# Altium schematic sheet DAM16_Ethernet.SchDoc
size A3
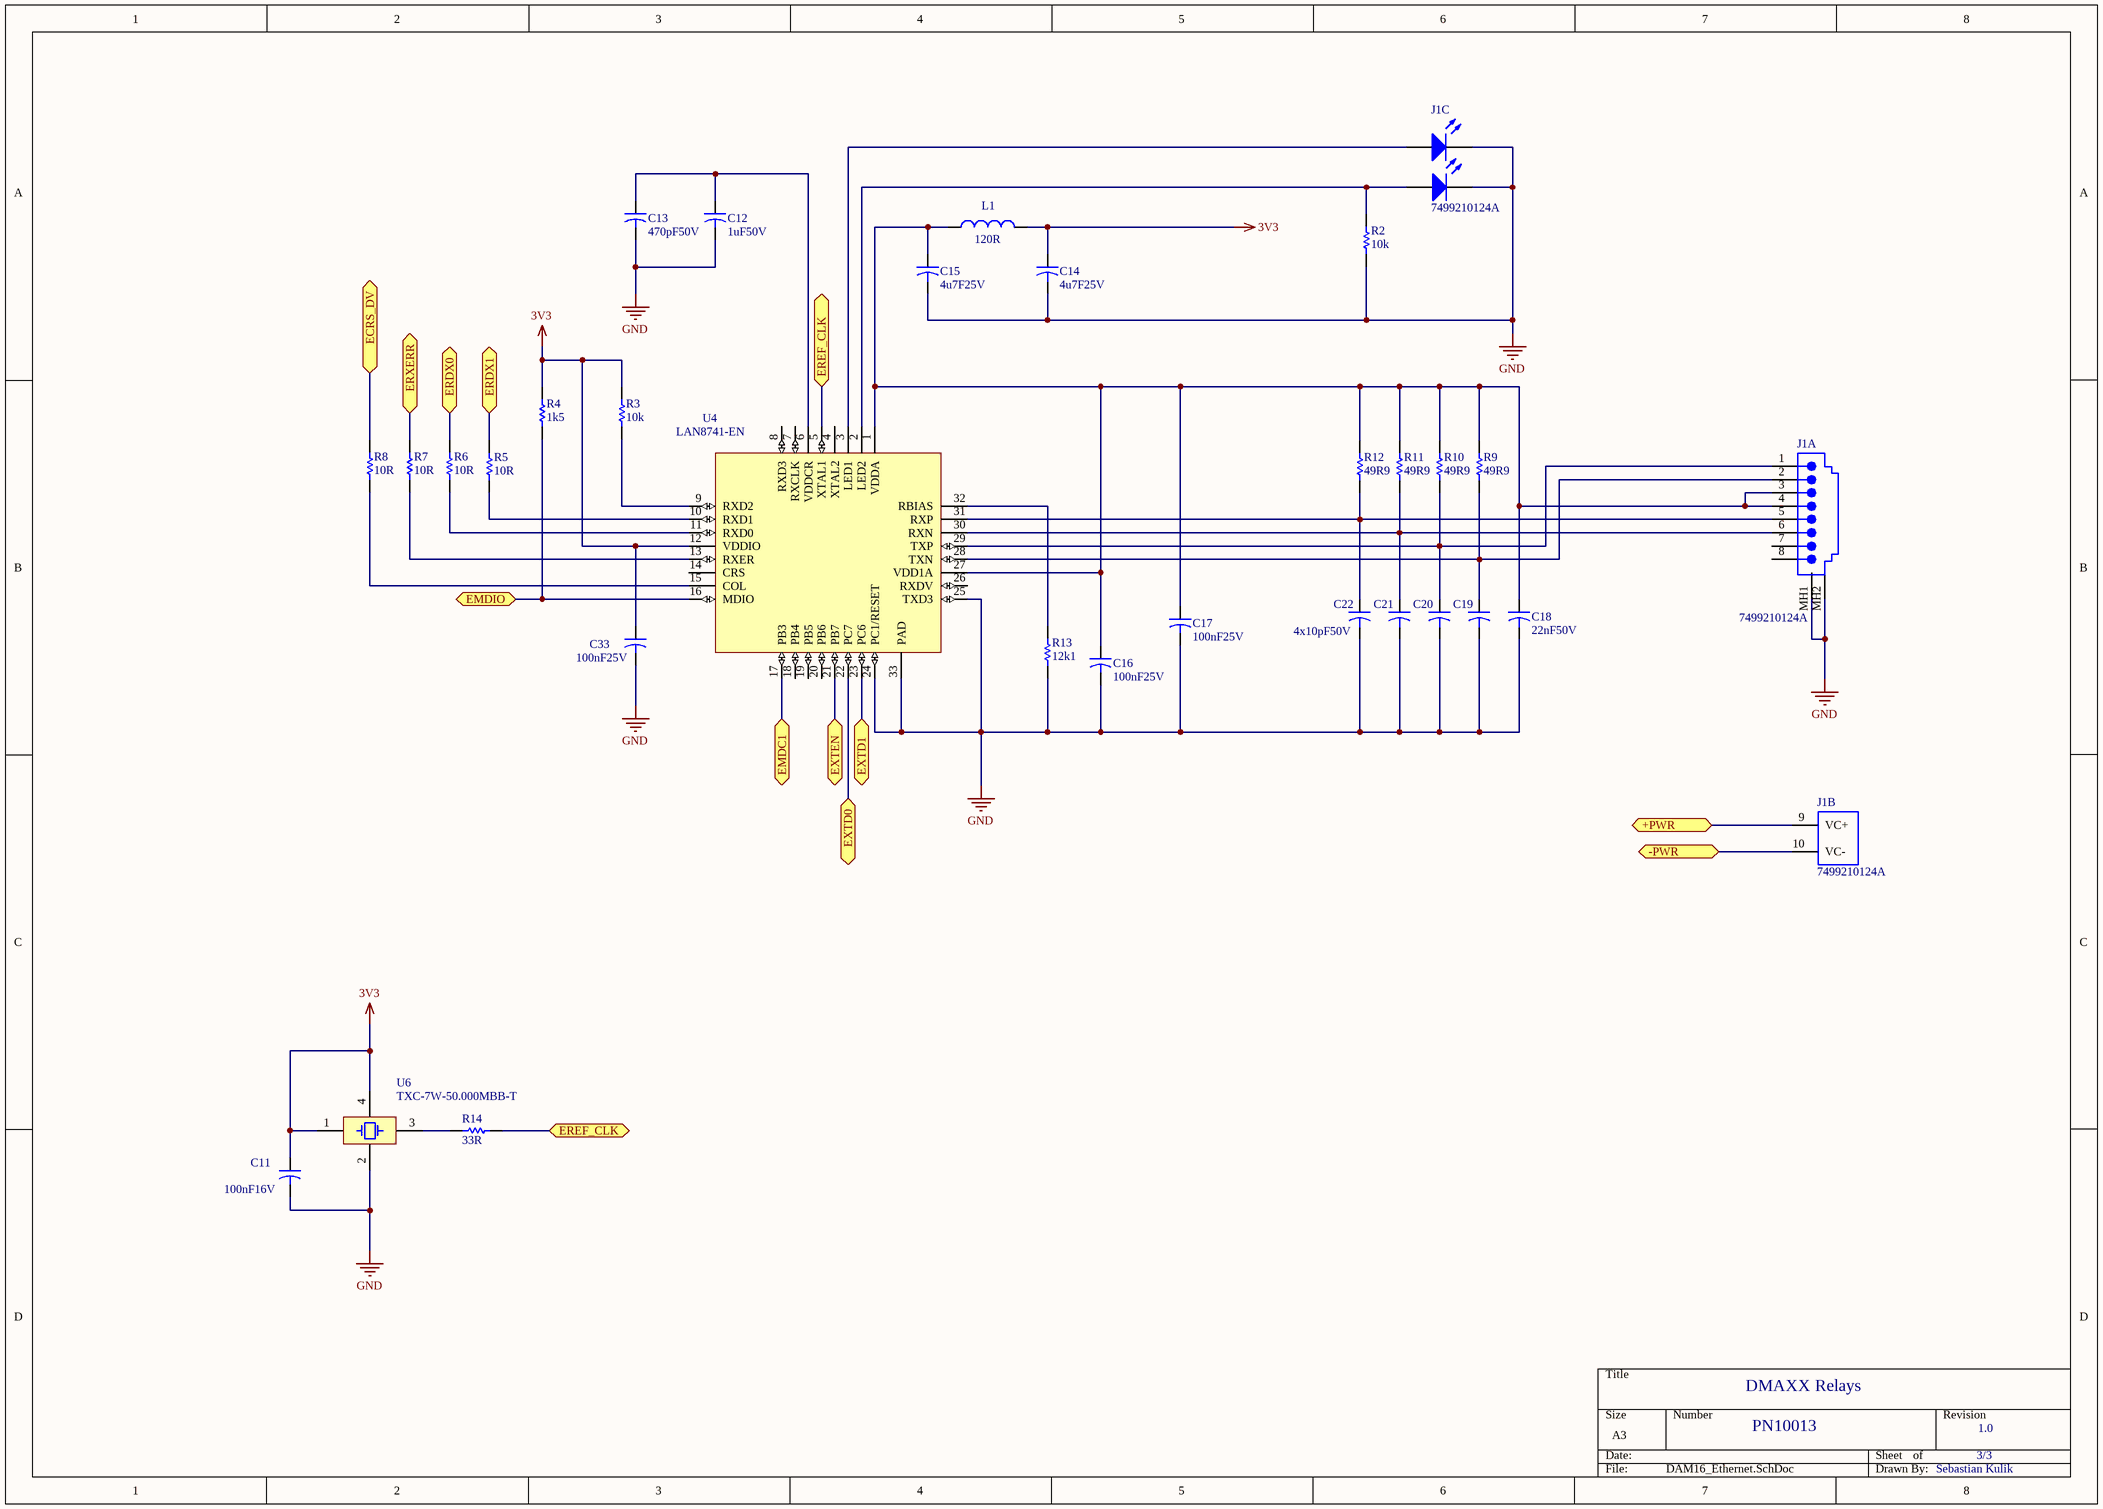
[diagram p0: DAM16_Ethernet.SchDoc]

## Parts
C11  value 100nF16V  [C0402]  (hidden comment: 100nF16V_0402)
C12  value 1uF50V  [C0603]  (hidden comment: 1uF50V_0603)
C13  value 470pF50V  [C0402]  (hidden comment: 470pF50V_0402)
C14  value 4u7F25V  [C0805]  (hidden comment: 4u7F25V_0805)
C15  value 4u7F25V  [C0805]  (hidden comment: 4u7F25V_0805)
C16  value 100nF25V  [C0402]  (hidden comment: 100nF25V_0402)
C17  value 100nF25V  [C0402]  (hidden comment: 100nF25V_0402)
C18  value 22nF50V  [C0603]  (hidden comment: 22nF50V_0603)
C19  10pF50V_0603  [C0603]  (value not drawn)
C20  10pF50V_0603  [C0603]  (value not drawn)
C21  10pF50V_0603  [C0603]  (value not drawn)
C22  10pF50V_0603  [C0603]  (value not drawn)
C33  value 100nF25V  [C0402]  (hidden comment: 100nF25V_0402)
J1  7499210124A  [7499210124A]  (parts A,B,C of 3)
L1  value 120R  [L0603]  (hidden comment: 120R4A_0603)
R2  value 10k  [R0402]  (hidden comment: 10k_0402)
R3  value 10k  [R0402]  (hidden comment: 10k_0402)
R4  value 1k5  [R0402]  (hidden comment: 1k5_0402)
R5  value 10R  [R0402]  (hidden comment: 10R_0402)
R6  value 10R  [R0402]  (hidden comment: 10R_0402)
R7  value 10R  [R0402]  (hidden comment: 10R_0402)
R8  value 10R  [R0402]  (hidden comment: 10R_0402)
R9  value 49R9  [R0402]  (hidden comment: 49R9_0402)
R10  value 49R9  [R0402]  (hidden comment: 49R9_0402)
R11  value 49R9  [R0402]  (hidden comment: 49R9_0402)
R12  value 49R9  [R0402]  (hidden comment: 49R9_0402)
R13  value 12k1  [R0603(1608)]  (hidden comment: 12k1_0603)
R14  value 33R  [R0402]  (hidden comment: 33R_0402)
U4  LAN8741-EN  [32M1-A_M]
U6  TXC-7W-50.000MBB-T  [TXC_7W]

## Ports
+PWR, -PWR, ECRS_DV, EMDC1, EMDIO, ERDX0, ERDX1, EREF_CLK, ERXERR, EXTD0, EXTD1, EXTEN

## Nets
3V3: C11.1 C14.1 C33.1 L1.2 R3.2 R4.2 U4.12(VDDIO) U6.1(E/D) U6.4(VCC)
GND: C11.2 C12.2 C13.2 C14.2 C15.2 C16.2 C17.2 C18.2 C19.2 C20.2 C21.2 C22.2 C33.2 J1.11(K) J1.13(K) J1.MH1(Shield) J1.MH2(Shield) R2.1 R13.1 U4.24(PC1/RESET) U4.25(TXD3) U4.33(PAD) U6.2(GND)
+PWR: J1.9(VC+) ; port +PWR
-PWR: J1.10(VC-) ; port -PWR
ECRS_DV: R8.2 ; port ECRS_DV
EMDC1: U4.17(PB3) ; port EMDC1
EMDIO: R4.1 U4.16(MDIO) ; port EMDIO
ERDX0: R6.2 ; port ERDX0
ERDX1: R5.1 ; port ERDX1
EREF_CLK: R14.2 U4.5(XTAL1) ; port EREF_CLK
ERXERR: R7.2 ; port ERXERR
EXTD0: U4.22(PC7) ; port EXTD0
EXTD1: U4.23(PC6) ; port EXTD1
EXTEN: U4.21(PB7) ; port EXTEN
NetC12_1: C12.1 C13.1 U4.6(VDDCR)
NetC15_1: C15.1 C16.1 C17.1 C18.1 J1.3 J1.4 L1.1 R9.2 R10.2 R11.2 R12.2 U4.1(VDDA) U4.27(VDD1A)
NetC19_1: C19.1 J1.2 R9.1 U4.28(TXN)
NetC20_1: C20.1 J1.1 R10.1 U4.29(TXP)
NetC21_1: C21.1 J1.6 R11.1 U4.30(RXN)
NetC22_1: C22.1 J1.5 R12.1 U4.31(RXP)
NetJ1_12: J1.12(A) U4.3(LED1)
NetJ1_14: J1.14(A) R2.2 U4.2(LED2)
NetR3_1: R3.1 U4.9(RXD2)
NetR5_2: R5.2 U4.10(RXD1)
NetR6_1: R6.1 U4.11(RXD0)
NetR7_1: R7.1 U4.13(RXER)
NetR8_1: R8.1 U4.15(COL)
NetR13_2: R13.2 U4.32(RBIAS)
NetR14_1: R14.1 U6.3(OSC2)

Not connected (* = marked no-connect by the designer): J1 7 8; U4 4(XTAL2) 7(RXCLK) 8(RXD3) 14(CRS) 18(PB4) 19(PB5) 20(PB6) 26(RXDV)

## Notes on the sheet
- (near C22) 4x10pF50V
- DMAXX Relays
- PN10013
- 3/3
- 1.0
- Sebastian Kulik

## Library data of the parts
C11 = 100nF16V_0402: Capacitor; Part Description: TDK. CGA series, X7R, 10%, 16V; Deliverer PartNr: 2210748RL; Manufacturer: TDK; Manufacturer PartNr: CGA2B1X7R1C104K050BC; Deliverer: Farnell; TDFE-PN: C0025; Published: 12.02.2014; Publisher: Sebastian Kulik; PackageDescription: C0403
C12 = 1uF50V_0603: C series, X5R, 10%; Deliverer PartNr: 2211179RL; Manufacturer: TDK; Manufacturer PartNr: C1608X5R1H105K080AB; Deliverer: Farnell; TDFE-PN: C0037; Published: 13.02.2014; Part Description: C series, X5R, 10%; Publisher: Sebastian Kulik; PackageDescription: C0603
C13 = 470pF50V_0402: AVX, 50V; Deliverer PartNr: 1657927; Manufacturer PartNr: 04025A471JAT2A; Deliverer: Farnell; TDFE-PN: C0030; Published: 13.02.2014; Part Description: AVX,50V; Publisher: Sebastian Kulik; PackageDescription: C0403; Manufacturer: AVX
C14 C15 = 4u7F25V_0805: TDK  C series, X7R, 10%, 25V; Deliverer PartNr: 2346943RL; Manufacturer PartNr: C2012X7R1E475K125AB; Deliverer: Farnell; TDFE-PN: C0035; Published: 13.02.2014; Part Description: TDK  C series, X7R, 10%, 25V; Publisher: Sebastian Kulik; PackageDescription: C0805; Manufacturer: TDK
C16 C17 C33 = 100nF25V_0402: AVX, X5R, 10%, 25V; Deliverer PartNr: 2280767; Manufacturer PartNr: 04023D104KAT2A; Deliverer: Farnell; TDFE-PN: C0036; Published: 13.02.2014; Part Description: AVX, X5R, 10%, 25V; Publisher: Sebastian Kulik; PackageDescription: C0403; Manufacturer: AVX
C18 = 22nF50V_0603: AVX ,  X7R, 5%, 50V; Deliverer PartNr: 2332645RL; Manufacturer PartNr: 06035C223JAT2A; Deliverer: Farnell; TDFE-PN: C0034; Published: 13.02.2014; Part Description: AVX ,  X7R, 5%, 50V; Publisher: Sebastian Kulik; PackageDescription: C0603; Manufacturer: AVX
C19-C22 = 10pF50V_0603: AVX ,  +-0.5pF, 50V; Deliverer PartNr: 2332595RL; Manufacturer PartNr: 06035A100DAT2A; Deliverer: Farnell; TDFE-PN: C0033; Published: 13.02.2014; Part Description: AVX ,  +-0.5pF, 50V; Publisher: Sebastian Kulik; PackageDescription: C0603; Manufacturer: AVX; Value: 10pF50V
J1 = Ethernet, POE, WE7499210124A: Modular Jack , Right Angle RJ-45, Low Profile; Deliverer PartNr: 2356103; Manufacturer: Wuerth Elektronik; Ports: 1; PCB_Mounting: Thru-Hole; Deliverer: Farnell; TDE-PN: CON0013; PackageReference: 7499210124A; Publisher: Sebastian Kulik; Manufacturer PartNr: 7499210124A
L1 = 120R4A_0603: Murata, Ferrit, 120Rx2A; Deliverer PartNr: 1515738RL; Manufacturer PartNr: BLM18PG121SN1D; Deliverer: Farnell; TDE-PN: P0016; Manufacturer: Murata; Published: 13.02.2014; Publisher: Sebastian Kulik
R2 R3 = 10k_0402: Vishay CRCW series, 125mW, 1%; Manufacturer PartNr: CRCW040210K0FKEAHP; Deliverer PartNr: 1738864; TDE-PN: R0012; Deliverer: Farnell; Published: 12.02.2014; PackageReference: 0402; Publisher: Sebastian Kulik; PackageDescription: 0402; Manufacturer: Vishay; Part Description: Vishay CRCW series, 125mW, 1%
R4 = 1k5_0402: Vishay CRCW series, 125mW, 1%; Manufacturer PartNr: CRCW04021K50FKEAHP; Deliverer PartNr: 1738852; Part Description: Vishay CRCW series, 63mW, 1%; TDE-PN: R0036; Deliverer: Farnell; Published: 13.02.2014; PackageReference: 0402; Publisher: Sebastian Kulik; PackageDescription: 0402; Manufacturer: Vishay
R5-R8 = 10R_0402: Vishay CRCW series, 125mW, 1%; Manufacturer PartNr: CRCW040210R0FKEAHP; Deliverer PartNr: 1738824RL; TDE-PN: R0015; Deliverer: Farnell; Published: 12.02.2014; PackageReference: 0402; Publisher: Sebastian Kulik; PackageDescription: 0402; Manufacturer: Vishay; Part Description: Vishay CRCW series, 125mW, 1%
R9-R12 = 49R9_0402: Vishay CRCW series, 63mW, 1%; Manufacturer PartNr: CRCW040249R9FKED; Deliverer PartNr: 2121437; TDE-PN: R0035; Deliverer: Farnell; Published: 13.02.2014; PackageReference: 0402; Publisher: Sebastian Kulik; PackageDescription: 0402; Manufacturer: Vishay; Part Description: Vishay CRCW series, 63mW, 1%
R13 = 12k1_0603: Vishay, CRCW series, 100mW, 1%; Manufacturer PartNr: CRCW060312K1FKEA; Deliverer PartNr: 2122502; TDE-PN: R0037; Deliverer: Farnell; Published: 11.02.2014; Publisher: Sebastian Kulik; PackageDescription: 0603; Manufacturer: Vishay; Part Desicription: Vishay, CRCW series, 100mW, 1%
R14 = 33R_0402: Vishay CRCW series, 63mW, 1%; Manufacturer PartNr: CRCW040233R0FKEAHP; Deliverer PartNr: 1738830; TDE-PN: R0037; Deliverer: Farnell; Published: 12.02.2014; PackageReference: 0402; Publisher: Sebastian Kulik; PackageDescription: 0402; Manufacturer: Vishay; Part Description: Vishay CRCW series, 63mW, 1%
U4 = LAN8741-EN: Ethernet Phy; Deliverer PartNr: 2373284; Manufacturer PartNr: LAN8741A-EN; Manufacturer: Microchip; TDE-PN: IC0036; Deliverer: Farnell; Published: 12.02.2014; LatestRevisionNote: IPC-7351 Footprint Added.; Publisher: Sebastian Kulik
U6 = TXC-7W-50.000MBB-T: Crystal; Deliverer PartNr: 1842144; Manufacturer: TXC; Deliverer: Farnell; TDE-PN: IC0037; Published: 17.02.2014; PackageReference: SOT23; Publisher: Sebastian Kulik; Manufacturer PartNr: 7W-50.000MBB-T